# EAGLE design ltc3490-led-driver-12mm-mk-1 (EAGLE 6.5.0)
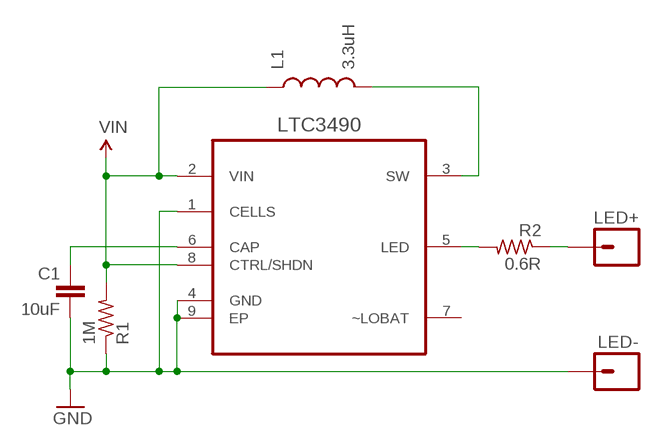
[diagram p0: schematic, sheet 1]

## Parts
C1  10uF  CAPACITOR-CERAMICC0603  [C0603]
L1  3.3uH  INDUCTORIFSC-0806  [INDUCTOR_2X1.6MM]
LED+  M01PTH-1.2MM  [1X01-1.2MM]
LED-  M01PTH-1.2MM-NS  [1X01-1.2MM-NS]
LTC3490  LTC3490EDDPBF  [DFN300X300X80-9N]
R1  1M  RESISTORR0402  [R0402]
R2  0.6R  RESISTORR1206  [R1206]

## Nets
GND: C1.2 LED-.P$1 LTC3490.1(CELLS) LTC3490.4(GND) LTC3490.9(EP) R1.1
N$1: LED+.P$1 R2.1
N$2: L1.P$2 LTC3490.3(SW)
N$3: C1.1 LTC3490.6(CAP)
N$5: LTC3490.5(LED) R2.2
VIN: L1.P$1 LTC3490.2(VIN) LTC3490.8(CTRL/SHDN) R1.2
Unconnected: LTC3490.7(~LOBAT)

## Library data of the parts
C1 = A_butts:CAPACITOR-CERAMIC: CAPACITOR, European symbol
L1 = A_butts:INDUCTOR: Inductors Basic Inductor/Choke - 0603 and 1206. Footprints are not proven and vary greatly between part numbers. SRN6045- 33uH, 20% 1.4A SDR0403-560KL - 56uH, 10%, 500mA RMS/740mA peak
LED+ LED- = A_butts:M01: Header 1 Standard 1-pin 0.1" header. Use with straight break away headers (SKU : PRT-00116), right angle break away headers (PRT-00553), swiss pins (PRT-00743), machine pins (PRT-00117), and female headers (PRT-00115).
LTC3490 = A_butts:LTC3490EDDPBF: Single Cell 350mA LED Driver; MPN: LTC3490EDD#PBF; OC_FARNELL: 1866350; OC_NEWARK: 56M7871; PACKAGE: DFN-8; SUPPLIER: Linear Technology
R1 R2 = A_butts:RESISTOR: RESISTOR, American symbol

## Board
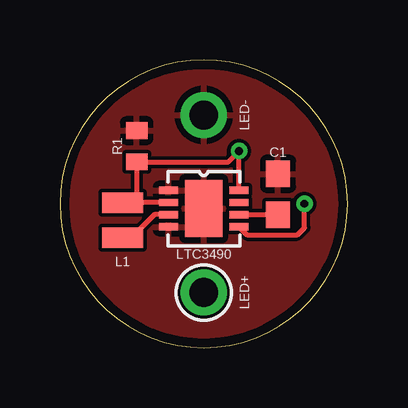
[diagram p1: board, top side]
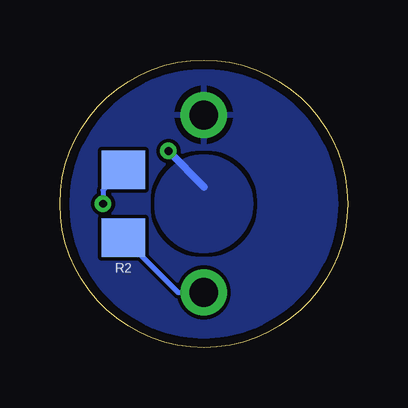
[diagram p2: board, bottom side, seen from below]

Size 12 x 12 mm. Coordinates in mm from the lower left corner, seen from the top.
Outline: 0,6 arc90 6,0 arc90 12,6 arc90 6,12 arc90 0,6
Copper layers (1*16): Top 0.0356mm / dielectric 1.5011mm / Bottom 0.0356mm
Design rules "LaenPCBOrder2": minimum track width 6mil, minimum drill 13mil, track to track 6mil, track to pad 6mil, pad to pad 6mil, via to via 6mil, smd to smd 6mil, copper to edge 15mil, drill to drill 6mil, minimum pad ring 7mil, minimum via ring 7mil, stop-mask expansion 3mil, vias tented up to drill 20mil, thermal gap 10mil

### Footprints (pad centres in the part's own frame; a part is rotated, then mirrored left to right if it is on the bottom)
C0603 = smd 1.1 x 1: 1 -0.85,0; 2 0.85,0
INDUCTOR_2X1.6MM = smd 0.85 x 1.7: P$1 -0.725,0; P$2 0.725,0
1X01-1.2MM = drill 1.2 pad 1.93: P$1 0,0
1X01-1.2MM-NS = drill 1.2 pad 1.93: P$1 0,0
DFN300X300X80-9N = smd 0.787 x 0.305: 1 -1.473,0.762; 2 -1.473,0.254; 3 -1.473,-0.254; 4 -1.473,-0.762; 5 1.473,-0.762; 6 1.473,-0.254; 7 1.473,0.254; 8 1.473,0.762 | smd 1.549 x 2.388: 9 0,0
R0402 = smd 0.7 x 0.9: 1 -0.65,0; 2 0.65,0
R1206 = smd 1.6 x 1.803: 1 -1.422,0; 2 1.422,0

### Placement (x,y rotation side)
C1  9.1,6.4 90 top
L1  2.61,5.31 270 top
LED+  6,2.3 0 top
LED-  6,9.7 90 top
LTC3490  6,5.8 0 top
R1  3.2,8.4 270 top
R2  9.35,6 90 bottom

### Tracks (layer width: path | path; a pad name or v marks a point on that pad's centre or on a via)
GND
  pour Top: 6,0 arc-90 0,6 arc-90 6,12 arc-90 12,6 arc-90
  pour Bottom (rank 6): 6,0 arc-90 0,6 arc-90 6,12 arc-90 12,6 arc-90
N$1
  Bottom 0.2: R2.1 7.07,2.3 LED+.P$1
N$2
  Top 0.2: LTC3490.3 3.95,5.55 3.3,4.9 2.92,4.9 L1.P$2
N$3
  Top 0.2: LTC3490.6 C1.1
N$5  (via drill 0.33)
  Top 0.2: LTC3490.5 7.81,4.7 9.9,4.7 10.2,5 v10.2,6
  Bottom 0.2: R2.2 10.2,6.57 v10.2,6
VIN  (via drill 0.33)
  Top 0.2: LTC3490.8 v7.47,8.2 7.02,7.75 R1.2 3.2,6.05 | LTC3490.2 3.2,6.05 | 3.2,6.05 2.63,6.05 L1.P$1
  Bottom 0.305: v7.47,8.2 6,6.7
  pour Bottom: 6,4 arc-90 4,6 arc-90 6,8 arc-90 8,6 arc-90